# EAGLE design Load Bank Mosfet Control Board (EAGLE 8.3.2)
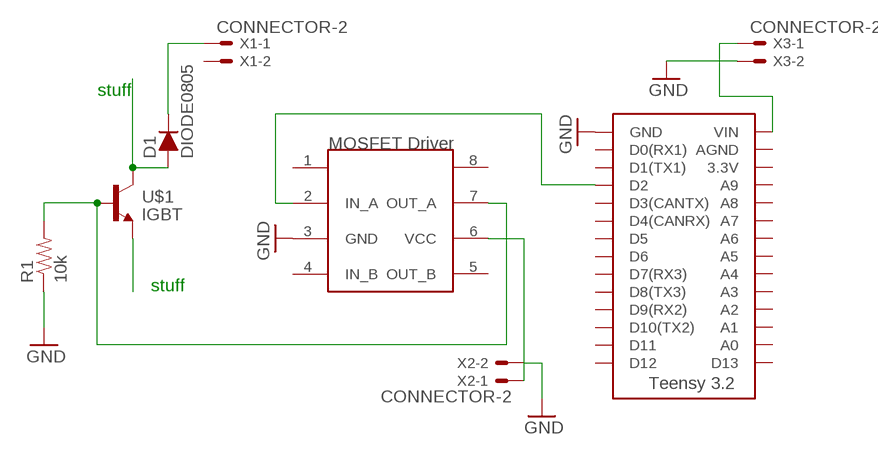
[diagram p0: schematic, sheet 1]

## Parts
D1  DIODE0805  [0805_D]
R1  10k  RESISTOR0402  [0402-RES]
U$1  IGBT  [IGBT]
U$2  MC34152  [SOIC-08]
U$3  TEENSY_3.2_SIMPLE  [TEENSY_3.2_SIMPLE]
X1  CONNECTOR-2  [MINIFIT_5566-2]
X2  CONNECTOR-2  [MINIFIT_5566-2]
X3  CONNECTOR-2  [MINIFIT_5566-2]

## Nets
GND: R1.1 U$2.3(GND) U$3.GND X2.2 X3.2
N$1: D1.C X1.1
N$2: D1.A U$1.P$2(COLLECTOR)
N$3: R1.2 U$1.P$3(BASE) U$2.7(OUT_A)
N$4: U$2.2(IN_A) U$3.D2
N$5: U$1.P$1(EMITTER) U$1.P$4(EMITTER)
N$6: U$2.6(VCC) X2.1
N$7: U$3.VIN X3.1
Unconnected: U$2.1 U$2.4(IN_B) U$2.5(OUT_B) U$2.8 U$3.3.3V U$3.A0 U$3.A1 U$3.A2 U$3.A3 U$3.A4 U$3.A5 U$3.A6 U$3.A7 U$3.A8 U$3.A9 U$3.AGND U$3.D0(RX1) U$3.D1(TX1) U$3.D3(CANTX) U$3.D4(CANRX) U$3.D5 U$3.D6 U$3.D7(RX3) U$3.D8(TX3) U$3.D9(RX2) U$3.D10(TX2) U$3.D11 U$3.D12 U$3.D13 X1.2

## Notes on the sheet
- stuff
- stuff

## Library data of the parts
D1 = HyTechDevices:DIODE: DIODE general purpose rectifier
R1 = HyTechDevices:RESISTOR: Resistor Basic schematic elements and footprints for 0603, 1206, and PTH resistors.
U$1 = HyTechDevices:IGBT
U$2 = HyTechDevices:MC34152: High Speed Dual MOSFET Drivers
U$3 = HyTechDevices:TEENSY_3.2_SIMPLE: Simple version of the Teensy 3.2 board that only uses the 2 main rows of pins, not the inner pins or the pins opposite the usb port.
X1-X3 = HyTechDevices:CONNECTOR-2: Mini-Fit Junior connector 2 pole Source: http://www.molex.com; OC_FARNELL: 1822072; OC_NEWARK: unknown

## Board
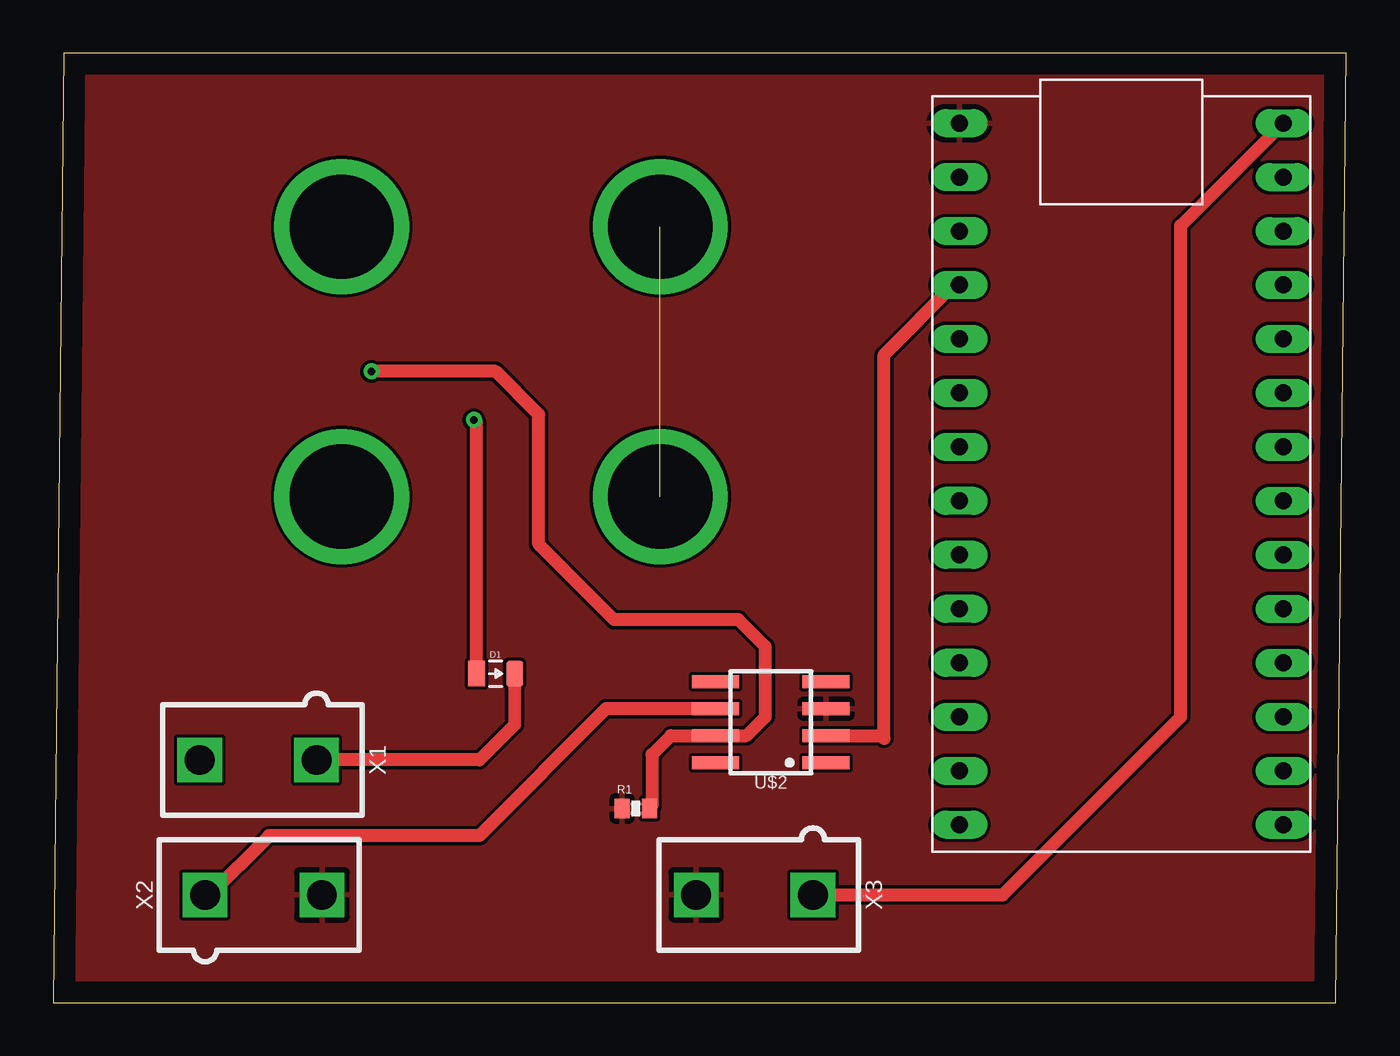
[diagram p1: board, top side]
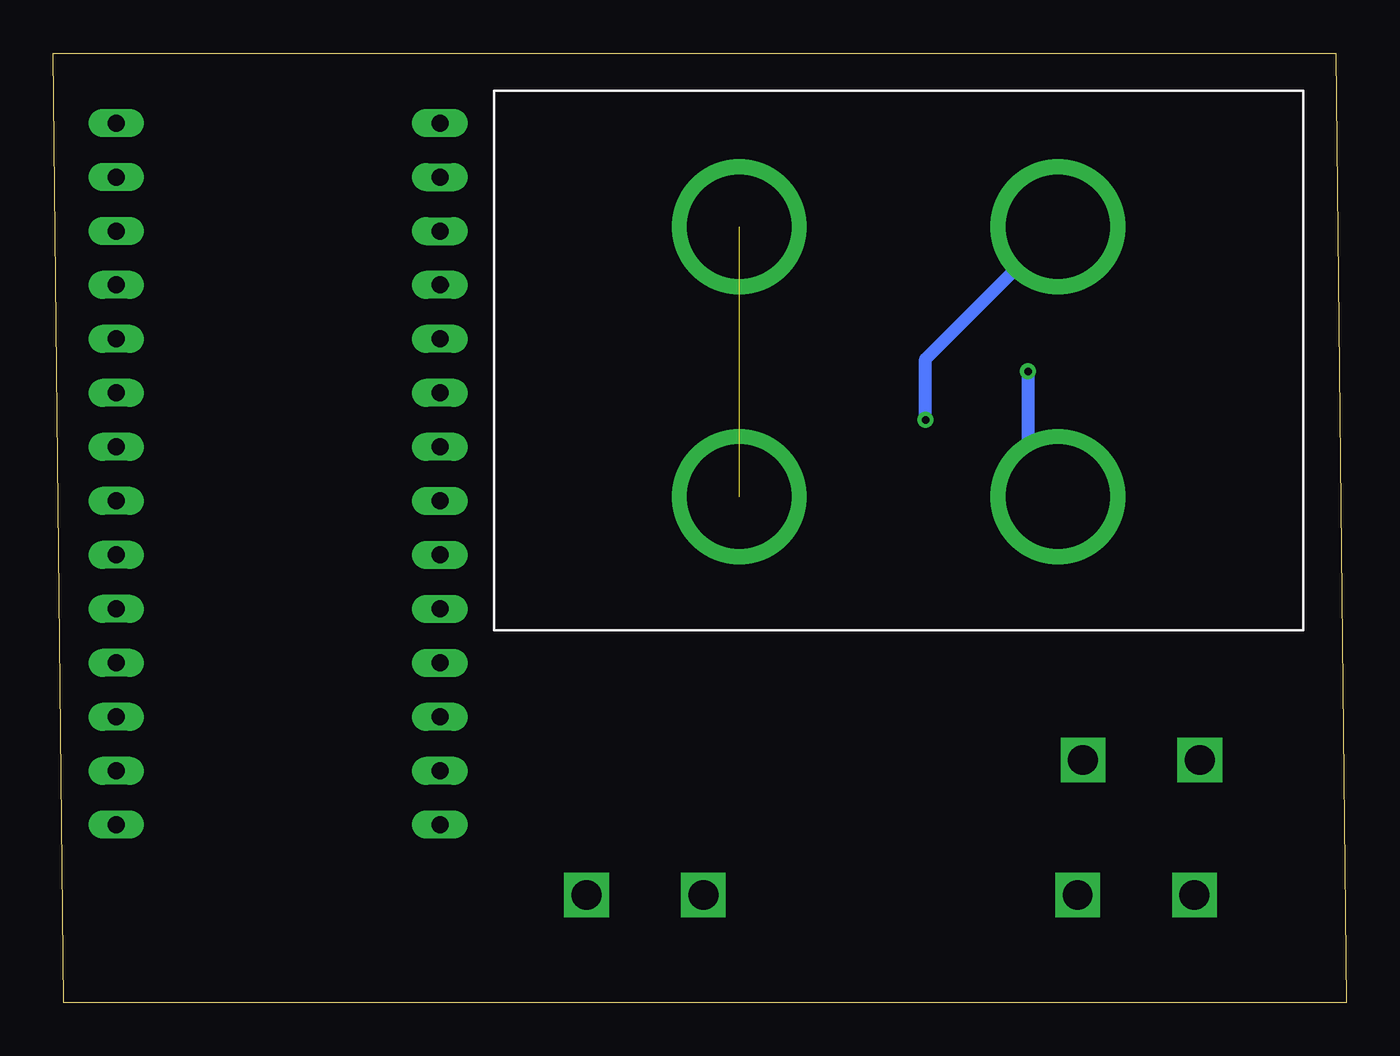
[diagram p2: board, bottom side, seen from below]

Size 60.88 x 44.69 mm. Coordinates in mm from the lower left corner, seen from the top.
Outline: 0,0 60.38,0 60.88,44.69 0.51,44.69 0,0
Copper layers (1*16): Top 0.035mm / dielectric 1.5mm / Bottom 0.035mm
Design rules "default": minimum track width 6mil, minimum drill 0.35mm, track to track 6mil, track to pad 6mil, pad to pad 6mil, via to via 6mil, smd to smd 6mil, copper to edge 40mil, drill to drill 6mil, minimum pad ring 10mil, minimum via ring 8mil, stop-mask expansion 4mil, vias tented up to drill 0mil, thermal gap 10mil

### Footprints (pad centres in the part's own frame; a part is rotated, then mirrored left to right if it is on the bottom)
0805_D = smd 0.8 x 1.2: A -0.9,0; C 0.9,0
0402-RES = smd 0.7 x 0.9: 1 -0.65,0; 2 0.65,0
IGBT = drill 4.9 pad 6.35: P$1 11.55,19; P$2 26.55,19; P$3 26.55,6.3; P$4 11.55,6.3
SOIC-08 = smd 0.6 x 2.2: 1 -1.905,-2.6; 2 -0.635,-2.6; 3 0.635,-2.6; 4 1.905,-2.6; 5 1.905,2.6; 6 0.635,2.6; 7 -0.635,2.6; 8 -1.905,2.6
TEENSY_3.2_SIMPLE = drill 0.8 long: 3.3V 16.51,29.21; A0 16.51,3.81; A1 16.51,6.35; A2 16.51,8.89; A3 16.51,11.43; A4 16.51,13.97; A5 16.51,16.51; A6 16.51,19.05; A7 16.51,21.59; A8 16.51,24.13; A9 16.51,26.67; AGND 16.51,31.75; D0(RX1) 1.27,31.75; D1(TX1) 1.27,29.21; D2 1.27,26.67; D3(CANTX) 1.27,24.13; D4(CANRX) 1.27,21.59; D5 1.27,19.05; D6 1.27,16.51; D7(RX3) 1.27,13.97; D8(TX3) 1.27,11.43; D9(RX2) 1.27,8.89; D10(TX2) 1.27,6.35; D11 1.27,3.81; D12 1.27,1.27; D13 16.51,1.27; GND 1.27,34.29; VIN 16.51,34.29
MINIFIT_5566-2 = drill 1.4 square: 1 0,-2.75; 2 0,2.75

### Placement (x,y rotation side)
D1  20.83,15.49 0 top
R1  27.43,9.14 0 top
U$1  40.13,17.53 0 bottom
U$2  33.78,13.21 90 top
U$3  41.4,7.11 0 top
X1  9.65,11.43 90 top
X2  9.91,5.08 270 top
X3  33.02,5.08 90 top

### Tracks (layer width: path | path; a pad name or v marks a point on that pad's centre or on a via)
GND
  pour Top: -56.39,47.5 59.18,47.5 60.45,46.23 60.45,-37.59 59.18,-38.86 -48.77,-38.86 -48.77,39.88
N$1
  Top 0.61: D1.C 21.73,13.09 20.07,11.43 X1.1
N$2  (via drill 0.35)
  Top 0.61: D1.A 19.93,27.32 v19.81,27.43
  Bottom 0.61: v19.81,27.43 19.81,30.3 U$1.P$2
N$3  (via drill 0.35)
  Top 0.61: R1.2 28.19,9.26 28.19,11.68 29.08,12.57 U$2.7 32.64,12.57 33.53,13.46 33.53,16.76 32.26,18.03 26.42,18.03 22.86,21.59 22.86,27.69 20.83,29.72 v14.99,29.72
  Bottom 0.61: v14.99,29.72 14.99,25.23 U$1.P$3
N$4  (via drill 0.35)
  Top 0.61: U$3.D2 v42.42,33.78 39.12,30.48 39.12,12.45 38.99,12.57 U$2.2
N$5  (1 unrouted)
N$6
  Top 0.61: X2.1 7.26,4.98 10.16,7.87 20.07,7.87 26.03,13.84 U$2.6
N$7
  Top 0.61: X3.1 44.7,5.08 53.09,13.46 53.09,36.58 U$3.VIN